# EasyEDA Pro project CM5_Mobo_final.epro, board PCB1
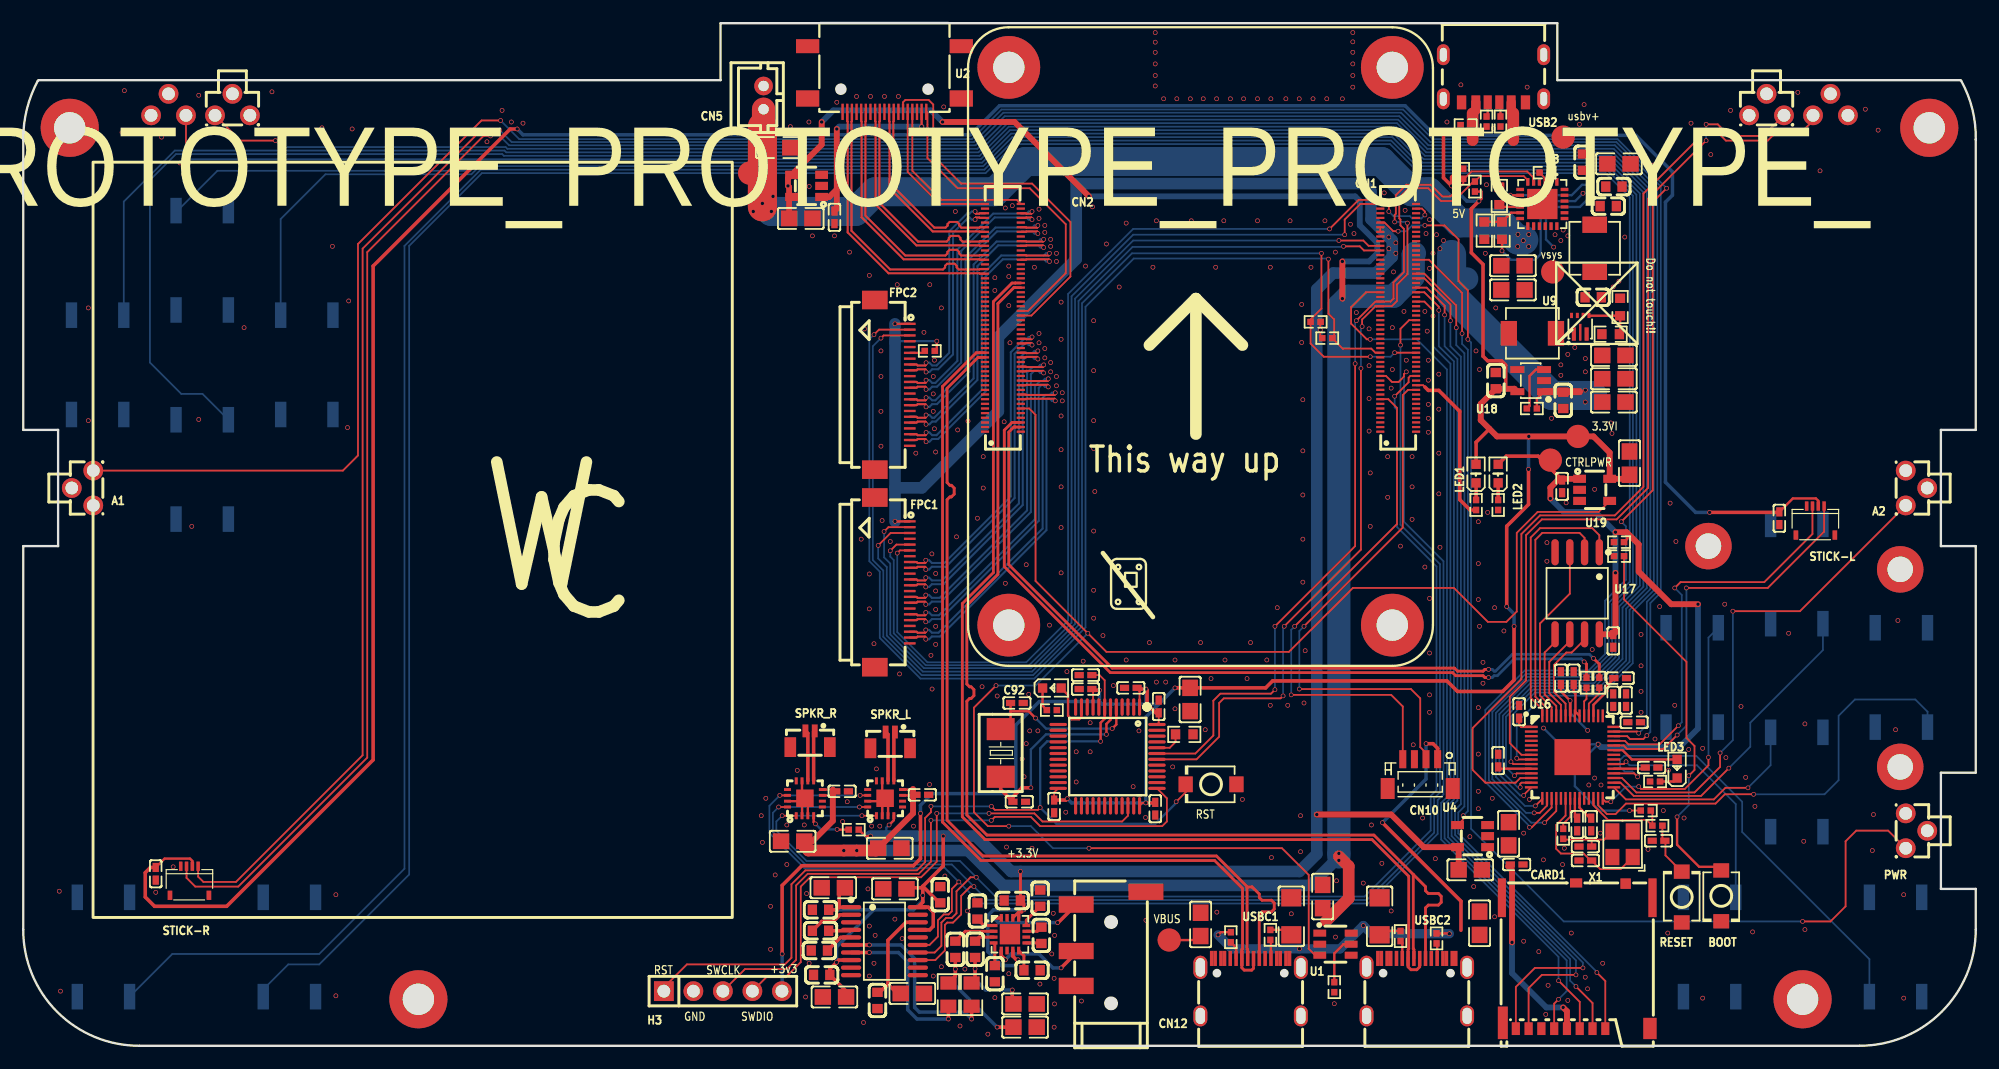
[diagram p1: board, top side]
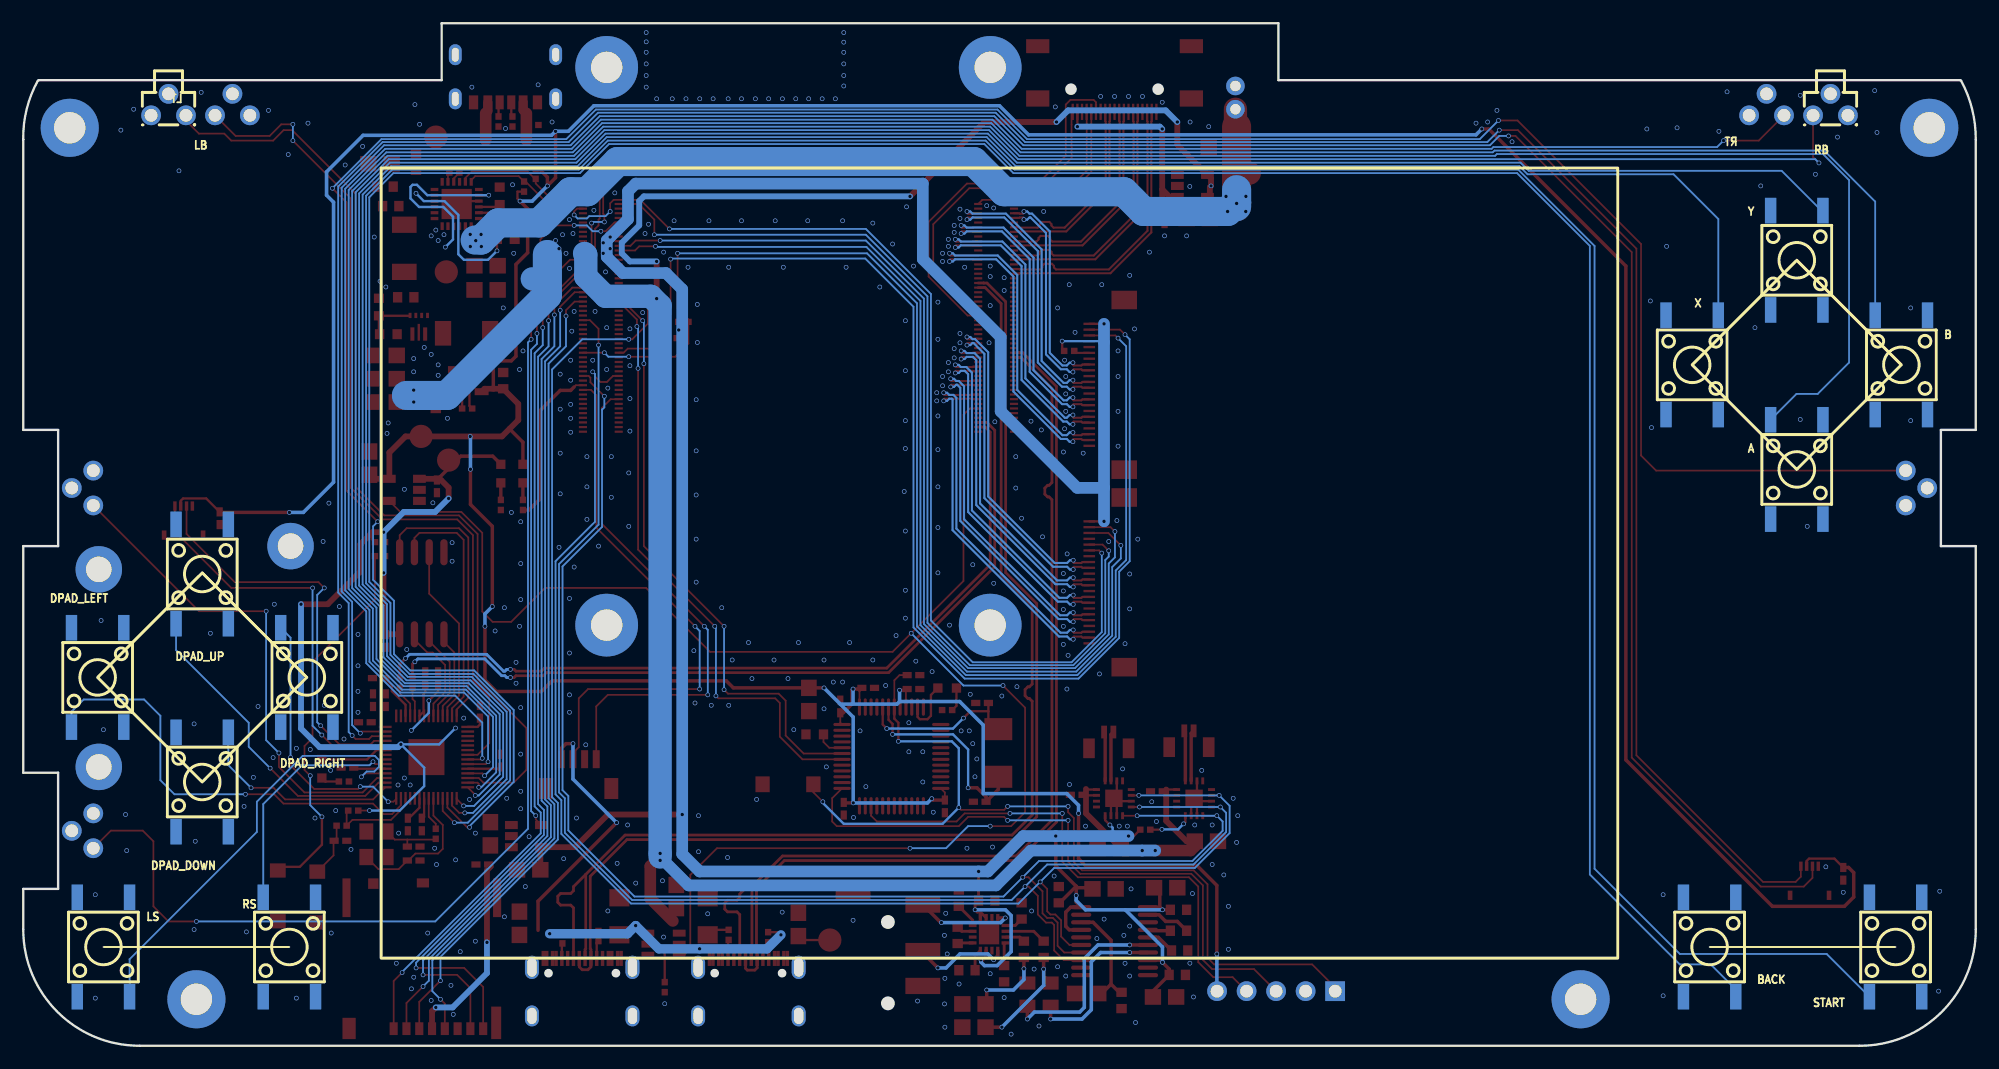
[diagram p2: board, bottom side, seen from below]

Outline 168 x 88 mm; copper layers: Top Layer, Inner1, Inner2, Bottom Layer. Coordinates in mm from the lower left corner of the outline.
Outline path: 168,78 arc(167.71,80.61) 166.75,83.05 arc(166.71,83.09) 166.66,83.1 132,83.1 132,88 60,88 60,83.1 1.34,83.1 arc(1.29,83.09) 1.26,83.05 arc(0.31,80.6) 0,78 0,53 3,53 3,43 0,43 0,10 arc(2.92,2.92) 10,0 158,0 arc(165.07,2.93) 168,10 168,13.5 165,13.5 165,23.5 168,23.5 168,43 165,43 165,53 168,53 168,78 ; 168,78 arc(168,77.99) 168,77.99
Stack: Top Layer 0.035mm 外层铜厚1oz / Dielectric1 0.2104mm 7628 RC49% 8.6mil / Inner1 0.0152mm 内层铜厚 / Dielectric2 1.065mm 1.1mm H/HOZ 含铜 / Inner2 0.0152mm 内层铜厚 / Dielectric3 0.2104mm 7628 RC49% 8.6mil / Bottom Layer 0.035mm 外层铜厚1oz

## Design rules (mm)
net MIPI1_D2_N: 100OHM, MIPI2
net HDMI0_SCL: 100OHM
net MIPI1_D3_P: 100OHM, MIPI1
net MIPI1_D2_P: 100OHM, MIPI2
net HDMI0_SDA: 100OHM
net MIPI1_D3_N: 100OHM, MIPI1
net MIPI1_C_P: 100OHM, MIPI5
net HDMI0_CLK_N: 100OHM, HDMI8
net HDMI0_CLK_P: 100OHM, HDMI8
net MIPI1_C_N: 100OHM, MIPI5
net HDMI0_TX0_N: 100OHM, HDMI7
net MIPI1_D1_P: 100OHM, MIPI3
net HDMI0_TX0_P: 100OHM, HDMI7
net MIPI1_D1_N: 100OHM, MIPI3
net HDMI0_TX1_N: 100OHM, HDMI6
net MIPI1_D0_P: 100OHM, MIPI4
net HDMI0_TX1_P: 100OHM, HDMI6
net MIPI1_D0_N: 100OHM, MIPI4
net HDMI0_TX2_N: 100OHM, HDMI5
net USB3-1-TX_P: 90OHM, USB3
net HDMI0_TX2_P: 100OHM, HDMI5
net USB3-1-TX_N: 90OHM, USB3
net HDMI1_CLK_N: 100OHM, HDMI4
net USB3-1-D_N: 90OHM, USB5
net HDMI1_CLK_P: 100OHM, HDMI4
net USB3-1-D_P: 90OHM, USB5
net HDMI1_TX0_N: 100OHM, HDMI3
net USB3-1-RX_P: 90OHM, USB4
net HDMI1_TX0_P: 100OHM, HDMI3
net USB3-1-RX_N: 90OHM, USB4
net HDMI1_TX1_N: 100OHM, HDMI2
net HDMI0_HOTPLUG: 100OHM
net HDMI1_TX1_P: 100OHM, HDMI2
net HDMI0_CEC: 100OHM
net HDMI1_CEC: 100OHM
net HDMI1_TX2_N: 100OHM, HDMI1
net HDMI1_SCL: 100OHM
net HDMI1_TX2_P: 100OHM, HDMI1
net HDMI1_SDA: 100OHM
net HDMI1_HOTPLUG: 100OHM
net USB3-0-TX_P: 90OHM, USB6
net MIPI0_D3_P: 100OHM, MIPI6
net MIPI0_D3_N: 100OHM, MIPI6
net USB3-0-TX_N: 90OHM, USB6
net USB3-0-D_N: 90OHM, USB8
net MIPI0_D2_P: 100OHM, MIPI7
net USB3-0-D_P: 90OHM, USB8
net MIPI0_D2_N: 100OHM, MIPI7
net MIPI0_C_P: 100OHM, MIPI10
net USB3-0-RX_P: 90OHM, USB7
net USB3-0-RX_N: 90OHM, USB7
net MIPI0_C_N: 100OHM, MIPI10
net MIPI0_D1_P: 100OHM, MIPI8
net MIPI0_D1_N: 100OHM, MIPI8
net MIPI0_D0_P: 100OHM, MIPI9
net MIPI0_D0_N: 100OHM, MIPI9
net USB2_P: 90OHM, USB9
net USB2_N: 90OHM, USB9
template: User Custom Config
spacing copperThickness1oz (default): track to track 0.102, other pairs 0.152 to 0.3
spacing copperThickness2oz: track to track 0.203, other pairs 0.152 to 0.3
track width copperThickness1oz (default): min 0.127, default 0.254, max 3
track width copperThickness2oz: min 0.203, default 0.254, max 2.54
differential pair differentialPair (default): width min 0.127, default 0.254, max 2.54; gap min 0.152, default 0.152
differential pair 100OHM: width min 0.177, default 0.177, max 0.177; gap min 0.15, default 0.15
differential pair 90OHM: width min 0.239, default 0.239, max 0.239; gap min 0.15, default 0.15
via viaSize (default): diameter min 0.4, default 0.61, max 10; hole min 0.3, default 0.305, max 6.3
net GND uses copperRegion1
net MIPI1_D2_N uses 100OHM
net MIPI1_D3_P uses 100OHM
net MIPI1_D2_P uses 100OHM
net MIPI1_D3_N uses 100OHM
net MIPI1_C_P uses 100OHM
net HDMI0_CLK_N uses 100OHM
net HDMI0_CLK_P uses 100OHM
net MIPI1_C_N uses 100OHM
net HDMI0_TX0_N uses 100OHM
net MIPI1_D1_P uses 100OHM
net HDMI0_TX0_P uses 100OHM
net MIPI1_D1_N uses 100OHM
net HDMI0_TX1_N uses 100OHM
net MIPI1_D0_P uses 100OHM
net HDMI0_TX1_P uses 100OHM
net MIPI1_D0_N uses 100OHM
net HDMI0_TX2_N uses 100OHM
net USB3-1-TX_P uses 90OHM
net HDMI0_TX2_P uses 100OHM
net USB3-1-TX_N uses 90OHM
net HDMI1_CLK_N uses 100OHM
net USB3-1-D_N uses 90OHM
net HDMI1_CLK_P uses 100OHM
net USB3-1-D_P uses 90OHM
net HDMI1_TX0_N uses 100OHM
net USB3-1-RX_P uses 90OHM
net HDMI1_TX0_P uses 100OHM
net USB3-1-RX_N uses 90OHM
net HDMI1_TX1_N uses 100OHM
net HDMI1_TX1_P uses 100OHM
net HDMI1_TX2_N uses 100OHM
net HDMI1_TX2_P uses 100OHM
net USB3-0-TX_P uses 90OHM
net MIPI0_D3_P uses 100OHM
net MIPI0_D3_N uses 100OHM
net USB3-0-TX_N uses 90OHM
net USB3-0-D_N uses 90OHM
net MIPI0_D2_P uses 100OHM
net USB3-0-D_P uses 90OHM
net MIPI0_D2_N uses 100OHM
net MIPI0_C_P uses 100OHM
net USB3-0-RX_P uses 90OHM
net USB3-0-RX_N uses 90OHM
net MIPI0_C_N uses 100OHM
net MIPI0_D1_P uses 100OHM
net MIPI0_D1_N uses 100OHM
net MIPI0_D0_P uses 100OHM
net MIPI0_D0_N uses 100OHM
net USB2_P uses 90OHM
net USB2_N uses 90OHM
diff pair MIPI2 uses 100OHM
diff pair MIPI1 uses 100OHM
diff pair MIPI5 uses 100OHM
diff pair HDMI8 uses 100OHM
diff pair HDMI7 uses 100OHM
diff pair MIPI3 uses 100OHM
diff pair HDMI6 uses 100OHM
diff pair MIPI4 uses 100OHM
diff pair HDMI5 uses 100OHM
diff pair USB3 uses 90OHM
diff pair HDMI4 uses 100OHM
diff pair USB5 uses 90OHM
diff pair HDMI3 uses 100OHM
diff pair USB4 uses 90OHM
diff pair HDMI2 uses 100OHM
diff pair HDMI1 uses 100OHM
diff pair USB6 uses 90OHM
diff pair MIPI6 uses 100OHM
diff pair USB8 uses 90OHM
diff pair MIPI7 uses 100OHM
diff pair MIPI10 uses 100OHM
diff pair USB7 uses 90OHM
diff pair MIPI8 uses 100OHM
diff pair MIPI9 uses 100OHM
diff pair USB9 uses 90OHM
pour e2095 uses copperRegion1
pour e2106 uses copperRegion1
pour e2120 uses copperRegion1
pour e2138 uses copperRegion1
pour e2159 uses copperRegion1
pour e2176 uses copperRegion1
pour e2191 uses copperRegion1
pour e2230 uses copperRegion1
pour e2257 uses copperRegion1
pour e2916 uses copperRegion1
pour e2929 uses copperRegion1
pour e2950 uses copperRegion1
pour e2967 uses copperRegion1
pour e3011 uses copperRegion1
pour e7991 uses copperRegion1
pour e20596 uses copperRegion1
pour e2682 uses copperRegion1
pour e2683 uses copperRegion1
pour e2693 uses copperRegion1
pour e2725 uses copperRegion1
pour e2745 uses copperRegion1
pour e2834 uses copperRegion1
pour e1493 uses copperRegion1
pour e649 uses copperRegion1
pour e1359 uses copperRegion1
pour e1825 uses copperRegion1
pour e1839 uses copperRegion1

## Placement (name value [footprint] x y rotation side)
A  K2-1102SP-C4SC-04  [key-smd_4p-l6.0-w6.0-p4.50-ls9.5-bl]  15.4 49.6 180 bottom
A1  BX-TS-26-454543BSJ  [sw-th_3p-l4.5-w4.3-p3.00-ls1.9]  5.1 48 270 top
A2  BX-TS-26-454543BSJ  [sw-th_3p-l4.5-w4.3-p3.00-ls1.9]  162.9 48 90 top
B  K2-1102SP-C4SC-04  [key-smd_4p-l6.0-w6.0-p4.50-ls9.5-bl]  6.4 58.6 180 bottom
BACK  K2-1102SP-C4SC-04  [key-smd_4p-l6.0-w6.0-p4.50-ls9.5-bl]  22.9 8.5 0 bottom
BOOT  TS-1088-AR02016  [SW-SMD_L3.9-W3.0-P4.45]  146.1 12.9 270 top
C2  33pF  [C0402]  134.41 15.94 0 top
C3  10uF  [C0805]  111.81 12.84 90 top
C5  10uF  [C0805]  125.31 10.54 90 top
C6  10uF  [C0805]  101.31 10.44 90 top
C7  100nF  [C0402]  132.31 31.64 270 top
C9  10uF  [C0805]  127.81 18.24 90 top
C10  22uF  [C0805]  136.86 55.4 0 top
C11  22uF  [C0805]  136.86 57.4 0 top
C12  22uF  [C0805]  136.86 59.41 0 top
C13  100nF  [C0402]  138.61 27.84 180 top
C14  100nF  [C0402]  128.71 28.74 270 top
C15  100nF  [C0402]  133.41 31.64 270 top
C16  100nF  [C0402]  136.81 29.74 270 top
C17  1uF  [C0603]  135.09 64.41 0 top
C18  10uF  [C0805]  65 77.3 0 top
C19  10uF  [C0805]  128.18 67.13 180 top
C20  10uF  [C0805]  128.18 65.05 180 top
C25  1uF  [C0603]  132.51 55.54 270 top
C26  10uF  [C0805]  100.4 29.8 270 top
C27  100nF  [C0402]  88.7 20.6 270 top
C28  100nF  [C0402]  91.4 30.7 180 top
C29  100nF  [C0402]  97.4 20.4 270 top
C30  100nF  [C0402]  95.3 30.8 180 top
C33  1uF  [C0603]  126.71 57.24 90 top
C34  47nF  [C0603]  136.38 72.26 180 top
C35  4.7uF  [C0603]  136.86 73.94 0 top
C36  10uF  [C0805]  137.3 75.9 180 top
C37  1uF  [C0603]  134.21 76.04 270 top
C38  47uF  [C1206]  109.11 11.14 90 top
C39  47uF  [C1206]  116.71 11.14 90 top
C40  10uF  [C0805]  66.2 17.6 180 top
C41  100nF  [C0402]  70.46 21.9 0 top
C42  10uF  [C0805]  74.56 17 0 top
C43  100nF  [C0402]  77.36 21.6 0 top
C52  10uF  [C0805]  66.9 71.2 0 top
C53  10uF  [C0805]  124.51 15.14 180 top
C54  100nF  [C0402]  128.5 15.6 180 top
C55  100nF  [C0402]  136.81 34.84 90 top
C56  1uF  [C0402]  137.91 29.74 90 top
C57  1uF  [C0402]  137.41 31.64 0 top
C58  100nF  [C0402]  134.91 19.04 90 top
C59  100nF  [C0402]  140.11 23.94 180 top
C60  100nF  [C0402]  133.71 19.04 90 top
C61  100nF  [C0402]  126.91 24.54 270 top
C62  33pF  [C0402]  134.41 17.14 0 top
C63  100nF  [C0402]  140.71 17.64 0 top
C64  100nF  [C0402]  151.1 45.4 270 top
C65  100nF  [C0402]  11.4 14.8 270 top
C66  10uF  [C0805]  138.21 50.14 270 top
C67  100nF  [C0402]  132.41 48.14 90 top
C68  100nF  [C0402]  97.7 29.2 90 top
C69  100nF  [C0402]  91.4 31.9 180 top
C70  2.2uF  [C0603]  68.6 9.9 0 top
C71  2.2uF  [C0603]  68.5 8.2 0 top
C72  10uF  [C0805]  75 13.5 0 top
C73  10uF  [C0805]  76.5 4.5 0 top
C74  10uF  [C0805]  69.8 4.2 0 top
C75  10uF  [C0805]  69.7 13.6 0 top
C76  100nF  [C0603]  78.9 13 270 top
C77  100nF  [C0603]  68.6 11.7 0 top
C78  100nF  [C0603]  68.7 6.1 0 top
C79  100nF  [C0603]  73.5 3.9 270 top
C80  2.2nF  [C0805]  86.2 1.6 0 top
C81  2.2nF  [C0805]  86.2 3.6 0 top
C82  1uF  [C0603]  80.2 8.3 270 top
C83  1uF  [C0603]  81.9 8.3 270 top
C84  1uF  [C0603]  82.1 11.6 90 top
C85  1uF  [C0603]  83.6 6.2 270 top
C86  2.2uF  [C0603]  85.1 12.5 180 top
C87  1uF  [C0603]  87.5 12.7 90 top
C88  1uF  [C0603]  87.6 9.5 90 top
C89  1uF  [C0603]  86.8 6.5 180 top
C92  20pF  [C0402]  85.5 29.5 0 top
C93  20pF  [C0402]  85.7 21 0 top
C94  100nF  [C0402]  69.8 71.3 270 top
CARD1  5033981892  [TF-SMD_503398-1892]  133.71 7.74 180 top
CN1  DF40HC(3.0)-100DS-0.4V(51)  [CONN-SMD_DF40HC-3.0-100DS-0.4V-51]  118.3 62.65 270 top
CN2  DF40HC(3.0)-100DS-0.4V(51)  [CONN-SMD_DF40HC-3.0-100DS-0.4V-51]  84.29 62.65 270 top
CN5  B2B-PH-K-S(LF)(SN)  [CONN-TH_B2B-PH-K-S]  63.7 81.6 90 top
CN10  BM04B-SRSS-TB(LF)(SN)  [CONN-SMD_BM04B-SRSS-TB]  120.2 23.4 180 top
CN12  PJ-320D  [AUDIO-SMD_PJ-320D]  93.6 9.2 180 top
DPAD_DOWN  K2-1102SP-C4SC-04  [key-smd_4p-l6.0-w6.0-p4.50-ls9.5-bl]  152.6 22.7 0 bottom
DPAD_LEFT  K2-1102SP-C4SC-04  [key-smd_4p-l6.0-w6.0-p4.50-ls9.5-bl]  161.6 31.7 180 bottom
DPAD_RIGHT  K2-1102SP-C4SC-04  [key-smd_4p-l6.0-w6.0-p4.50-ls9.5-bl]  143.6 31.7 180 bottom
DPAD_UP  K2-1102SP-C4SC-04  [key-smd_4p-l6.0-w6.0-p4.50-ls9.5-bl]  152.6 40.6 180 bottom
FPC1  FH12-22S-0.5SH(55)  [FPC-SMD_22P-P0.50_FH12-22S-0.5SH-55]  74.77 39.88 270 top
FPC2  FH12-22S-0.5SH(55)  [FPC-SMD_22P-P0.50_FH12-22S-0.5SH-55]  74.77 56.88 270 top
H3  PZ254V-11-05P  [hdr-th_5p-p2.54-v-m]  60.2 4.7 0 top
L2  1uH  [IND-SMD_L4.4-W4.2]  135.21 68.63 90 top
L3  1uH  [IND-SMD_L4.4-W4.2]  129.85 61.32 180 top
LB  BX-TS-26-454543BSJ  [sw-th_3p-l4.5-w4.3-p3.00-ls1.9]  155.5 81 0 bottom
LED1  KT-0603W  [LED0603-R-RD_WHITE]  125.01 49.24 90 top
LED2  KT-0603W  [LED0603-R-RD_WHITE]  126.91 49.24 90 top
LED3  KT-0603R  [LED0603-RD]  142.31 23.84 90 top
LED4  KT-0603R  [LED0603-RD]  88.5 30.78 0 top
LS  K2-1102SP-C4SC-04  [key-smd_4p-l6.0-w6.0-p4.50-ls9.5-bl]  161.1 8.5 0 bottom
LT  BX-TS-26-454543BSJ  [sw-th_3p-l4.5-w4.3-p3.00-ls1.9]  150 81 180 top
NOREF  -  [Pad_e12002]  161.5 41 0 top
NOREF#2  -  [Pad_e16]  133.77 52.44 0 top
NOREF#3  -  [Pad_e11]  124.2 66 0 top
NOREF#4  -  [Pad_e104]  164 79 0 top
NOREF#5  -  [Pad_e20]  34 4 0 top
NOREF#6  -  [Pad_e9068]  84.8 36.2 0 top
NOREF#7  -  [Pad_e52]  131.4 50.4 0 top
NOREF#8  -  [Pad_e17]  4 79 0 top
NOREF#9  -  [Pad_e9069]  117.8 36.2 0 top
NOREF#10  -  [Pad_e9065]  84.8 84.2 0 top
NOREF#11  -  [Pad_e36]  62.5 75.1 0 top
NOREF#12  -  [Pad_e12003]  161.5 24 0 top
NOREF#13  -  [Pad_e12000]  145 43 0 top
NOREF#14  -  [Pad_e21]  153.1 4 0 top
NOREF#15  -  [Pad_e24]  98.6 9.1 0 top
NOREF#16  -  [Pad_e3]  131.6 66.6 0 top
NOREF#17  -  [Pad_e0]  132.5 78.2 0 top
NOREF#18  -  [Pad_e9067]  117.8 84.2 0 top
PWR  BX-TS-26-454543BSJ  [sw-th_3p-l4.5-w4.3-p3.00-ls1.9]  162.9 18.5 90 top
R1  2.2kΩ  [R0402]  124.11 79.24 180 top
R2  15kΩ  [R0402]  112.81 5.04 270 top
R3  2.2kΩ  [R0402]  78 59.8 180 top
R4  2.2kΩ  [R0402]  111.2 62.3 180 top
R5  2.2kΩ  [R0402]  112.2 60.9 0 top
R6  1kΩ  [R0402]  125.01 46.54 270 top
R11  5.1kΩ  [R0402]  127.11 79.54 270 top
R12  5.1kΩ  [R0402]  125.91 79.54 270 top
R16  120Ω  [R0603]  127.01 73.14 90 top
R17  10kΩ  [R0603]  127.24 70.16 90 top
R18  10kΩ  [R0603]  125.71 70.16 270 top
R27  4.7kΩ  [R0402]  130.91 75.14 0 top
R29  750kΩ  [R0603]  136.58 61.24 180 top
R30  100kΩ  [R0603]  137.4 63.58 270 top
R31  10kΩ  [R0603]  99.9 26.8 0 top
R32  1.5kΩ  [R0402]  88.5 28.89 0 top
R34  220kΩ  [R0402]  71.46 18.6 0 top
R37  10kΩ  [R0402]  123.91 75.04 90 top
R38  10kΩ  [R0402]  124.91 73.94 270 top
R39  1kΩ  [R0402]  126.91 46.54 270 top
R43  56kΩ  [R0402]  121.61 9.24 90 top
R44  56kΩ  [R0402]  118.51 9.44 90 top
R45  56kΩ  [R0402]  107.31 9.54 90 top
R46  56kΩ  [R0402]  103.91 9.34 90 top
R47  22Ω  [R0402]  134.51 31.24 270 top
R48  22Ω  [R0402]  135.61 31.24 90 top
R49  1kΩ  [R0402]  132.51 18.24 90 top
R50  1kΩ  [R0402]  140.61 18.94 180 top
R51  1kΩ  [R0402]  137.31 42.14 180 top
R52  10kΩ  [R0402]  139.61 20.24 0 top
R53  10kΩ  [R0402]  137.31 43.34 0 top
R54  1kΩ  [R0402]  140.41 22.74 0 top
R55  1kΩ  [R0402]  129.81 54.84 180 top
R56  470Ω  [R0805]  79.6 4.4 90 top
R57  470Ω  [R0805]  81.6 4.4 90 top
RB  BX-TS-26-454543BSJ  [sw-th_3p-l4.5-w4.3-p3.00-ls1.9]  12.5 81 0 bottom
RESET  TS-1088-AR02016  [SW-SMD_L3.9-W3.0-P4.45]  142.7 12.8 90 top
RS  K2-1102SP-C4SC-04  [key-smd_4p-l6.0-w6.0-p4.50-ls9.5-bl]  145.1 8.5 180 bottom
RST  TS-1088-AR02016  [SW-SMD_L3.9-W3.0-P4.45]  102.2 22.5 180 top
RT  BX-TS-26-454543BSJ  [sw-th_3p-l4.5-w4.3-p3.00-ls1.9]  18 81 180 top
SPKR_L  BM02B-SURS-TF(LF)(SN)  [CONN-SMD_2P-P0.80_BM02B-SURS-TF-LF-SN]  74.6 26.3 0 top
SPKR_R  BM02B-SURS-TF(LF)(SN)  [CONN-SMD_2P-P0.80_BM02B-SURS-TF-LF-SN]  67.7 26.4 0 top
START  K2-1102SP-C4SC-04  [key-smd_4p-l6.0-w6.0-p4.50-ls9.5-bl]  6.9 8.5 180 bottom
STICK-L  FH19C-4S-0.5SH(10)  [FPC-SMD_FH19C-4S-0.5SH]  154.2 45.2 0 top
STICK-R  FH19C-4S-0.5SH(10)  [FPC-SMD_FH19C-4S-0.5SH]  14.3 14.2 0 top
U1  AP22653W6-7  [SOT-23-6_L2.9-W1.6-P0.95-LS2.8-BR]  112.91 8.74 180 top
U2  HDMI-519S  [HDMI-SMD_19P-P0.40-H-F_HDMI-519S]  74.1 83.2 180 top
U4  RT9742GGJ5  [TSOT-23-5_L2.9-W1.6-P0.95-LS2.8-BR]  124.71 18.04 0 top
U5  STM32F103C8T6  [LQFP-48_L7.0-W7.0-P0.50-LS9.0-BL]  93.3 24.9 180 top
U8  BQ25890RTWR  [WQFN-24_L4.0-W4.0-P0.50-BL-EP]  130.71 72.44 180 top
U9  TPS61022RWUR  [VQFN-7_L2.0-W2.0-P0.55-TL_RWU]  133.97 62.05 90 top
U11  MAX98357AETE+T  [TQFN-16_L3.0-W3.0-P0.50-BL-EP1.5]  74.16 21.3 0 top
U12  MAX98357AETE+T  [TQFN-16_L3.0-W3.0-P0.50-BL-EP1.5]  67.26 21.3 0 top
U15  RT9742GGJ5  [TSOT-23-5_L2.9-W1.6-P0.95-LS2.8-BR]  67.4 74 0 top
U16  RP2040  [LQFN-56_L7.0-W7.0-P0.4-EP]  133.31 24.84 0 top
U17  W25Q128JVSIQTR  [SOIC-8_L5.3-W5.3-P1.27-LS8.0-BL]  133.71 38.94 180 top
U18  TPSPX3819M5-L-3-3  [SOT-23-5_L3.0-W1.6-P0.95-LS2.8-BR]  129.71 57.24 0 top
U19  RT9742GGJ5  [TSOT-23-5_L2.9-W1.6-P0.95-LS2.8-BR]  135.21 47.84 180 top
U20  PCM5102APWR  [TSSOP-20_L6.5-W4.4-P0.65-LS6.4-BL]  74.1 9 270 top
U21  PAM8908JER  [QFN-16_L3.0-W3.0-P0.50-BL-EP1.7]  84.9 9.6 270 top
USB2  TYPE-C-31-M-17  [USB-C-SMD_10P-P1.00-L6.8-W8.9]  126.51 83.24 180 top
USBC1  TYPE-C-31-M-12  [USB-C_SMD-TYPE-C-31-M-12]  105.61 5.04 0 top
USBC2  TYPE-C-31-M-12  [USB-C_SMD-TYPE-C-31-M-12]  119.91 5.04 0 top
X  K2-1102SP-C4SC-04  [key-smd_4p-l6.0-w6.0-p4.50-ls9.5-bl]  24.4 58.6 0 bottom
X1  12MHz  [OSC-SMD_4P-L3.2-W2.5-BL]  137.61 17.34 90 top
X2  8MHz  [CRYSTAL-SMD_L5.0-W3.2]  84.1 25.2 90 top
Y  K2-1102SP-C4SC-04  [key-smd_4p-l6.0-w6.0-p4.50-ls9.5-bl]  15.4 67.6 0 bottom

## Footprints (pads in the part's own frame, mm; a bottom-side part is the same pattern mirrored in y, then rotated)
AUDIO-SMD_PJ-320D
  rect 3x1.4 smd: 1(-3,-4.05) 2(3,4.05) 3(3,1.05) 4(3,-2.95)
C0402
  rect 0.79x0.54 smd: 1(-0.545,0) 2(0.545,0)
C0603
  rect 0.8x0.9 smd: 1(-0.7,0) 2(0.7,0)
C0805
  rect 1.41x1.35 smd: 1(-1,0) 2(1,0)
C1206
  rect 1.485x1.728 smd: 1(-1.593,0) 2(1.593,0)
CONN-SMD_2P-P0.80_BM02B-SURS-TF-LF-SN
  rect 0.5x1.1 smd: 1(0.4,0.7) 2(-0.4,0.7)
  rect 1x1.7 smd: 3(-1.7,-0.7) 4(1.7,-0.7)
CONN-SMD_BM04B-SRSS-TB
  rect 1.2x1.8 smd: 0(-2.8,1.262) 0(2.8,1.262)
  rect 0.6x1.55 smd: 1(-1.5,-1.262) 2(-0.5,-1.262) 3(0.5,-1.262) 4(1.5,-1.262)
CONN-SMD_DF40HC-3.0-100DS-0.4V-51
  rect 0.19x0.7 smd: 1(9.8,1.54) 2(9.8,-1.54) 3(9.4,1.54) 4(9.4,-1.54) 5(9,1.54) 6(9,-1.54) 7(8.6,1.54) 8(8.6,-1.54) 9(8.2,1.54) 10(8.2,-1.54) 11(7.8,1.54) 12(7.8,-1.54) 13(7.4,1.54) 14(7.4,-1.54) 15(7,1.54) 16(7,-1.54) 17(6.6,1.54) 18(6.6,-1.54) 19(6.2,1.54) 20(6.2,-1.54) 21(5.8,1.54) 22(5.8,-1.54) 23(5.4,1.54) 24(5.4,-1.54) 25(5,1.54) 26(5,-1.54) 27(4.6,1.54) 28(4.6,-1.54) 29(4.2,1.54) 30(4.2,-1.54) 31(3.8,1.54) 32(3.8,-1.54) 33(3.4,1.54) 34(3.4,-1.54) 35(3,1.54) 36(3,-1.54) 37(2.6,1.54) 38(2.6,-1.54) 39(2.2,1.54) 40(2.2,-1.54) 41(1.8,1.54) 42(1.8,-1.54) 43(1.4,1.54) 44(1.4,-1.54) 45(1,1.54) 46(1,-1.54) 47(0.6,1.54) 48(0.6,-1.54) 49(0.2,1.54) 50(0.2,-1.54) 51(-0.2,1.54) 52(-0.2,-1.54) 53(-0.6,1.54) 54(-0.6,-1.54) 55(-1,1.54) 56(-1,-1.54) 57(-1.4,1.54) 58(-1.4,-1.54) 59(-1.8,1.54) 60(-1.8,-1.54) 61(-2.2,1.54) 62(-2.2,-1.54) 63(-2.6,1.54) 64(-2.6,-1.54) 65(-3,1.54) 66(-3,-1.54) 67(-3.4,1.54) 68(-3.4,-1.54) 69(-3.8,1.54) 70(-3.8,-1.54) 71(-4.2,1.54) 72(-4.2,-1.54) 73(-4.6,1.54) 74(-4.6,-1.54) 75(-5,1.54) 76(-5,-1.54) 77(-5.4,1.54) 78(-5.4,-1.54) 79(-5.8,1.54) 80(-5.8,-1.54) 81(-6.2,1.54) 82(-6.2,-1.54) 83(-6.6,1.54) 84(-6.6,-1.54) 85(-7,1.54) 86(-7,-1.54) 87(-7.4,1.54) 88(-7.4,-1.54) 89(-7.8,1.54) 90(-7.8,-1.54) 91(-8.2,1.54) 92(-8.2,-1.54) 93(-8.6,1.54) 94(-8.6,-1.54) 95(-9,1.54) 96(-9,-1.54) 97(-9.4,1.54) 98(-9.4,-1.54) 99(-9.8,1.54) 100(-9.8,-1.54)
CONN-TH_B2B-PH-K-S
  round 1.6 hole 0.9: 1(1,0) 2(-1,0)
CRYSTAL-SMD_L5.0-W3.2
  rect 1.9x2.4 smd: 1(-2.05,0) 2(2.05,0)
FPC-SMD_22P-P0.50_FH12-22S-0.5SH-55
  rect 0.2x1 smd: 1(5.25,1.505) 2(4.75,1.505) 3(4.25,1.505) 4(3.75,1.505) 5(3.25,1.505) 6(2.75,1.505) 7(2.25,1.505) 8(1.75,1.505) 9(1.25,1.505) 10(0.75,1.505) 11(0.25,1.505) 12(-0.25,1.505) 13(-0.75,1.505) 14(-1.25,1.505) 15(-1.75,1.505) 16(-2.25,1.505) 17(-2.75,1.505) 18(-3.25,1.505) 19(-3.75,1.505) 20(-4.25,1.505) 21(-4.75,1.505) 22(-5.25,1.505)
  rect 1.6x2.2 smd: 23(7.3,-1.505) 24(-7.3,-1.505)
FPC-SMD_FH19C-4S-0.5SH
  rect 0.3x0.8 smd: 1(-0.75,1.25) 2(-0.25,1.25) 3(0.25,1.25) 4(0.75,1.25)
  rect 0.4x0.8 smd: 5(1.675,-1.25) 6(-1.675,-1.25)
HDMI-SMD_19P-P0.40-H-F_HDMI-519S
  rect 0.2x1.4 smd: 1(3.6,2.825) 2(3.2,2.825) 3(2.8,2.825) 4(2.4,2.825) 5(2,2.825) 6(1.6,2.825) 7(1.2,2.825) 8(0.8,2.825) 9(0.4,2.825) 10(0,2.824) 11(-0.4,2.825) 12(-0.8,2.825) 13(-1.2,2.825) 14(-1.6,2.825) 15(-2,2.825) 16(-2.4,2.825) 17(-2.8,2.825) 18(-3.2,2.825) 19(-3.6,2.825)
  rect 2x1.2 smd: 20(6.61,-2.825) 21(-6.61,-2.825)
  rect 2x1.4 smd: 22(6.61,1.675) 23(-6.61,1.675)
hdr-th_5p-p2.54-v-m
  rect 1.7x1.7 hole 1.1: 1(-5.08,0)
  round 1.7 hole 1.1: 2(-2.54,0) 3(0,0) 4(2.54,0) 5(5.08,0)
IND-SMD_L4.4-W4.2
  rect 1.4x2.12 smd: 1(2.028,0) 2(-2.028,0)
key-smd_4p-l6.0-w6.0-p4.50-ls9.5-bl
  rect 0.98x2.2 smd: 1(-2.25,-4.275) 2(-2.25,4.275) 3(2.25,-4.275) 4(2.25,4.275)
LED0603-R-RD_WHITE
  rect 0.8x0.8 smd: 1(0.8,0) 2(-0.8,0)
LED0603-RD
  rect 0.8x0.8 smd: 1(-0.799,0) 2(0.799,0)
LQFN-56_L7.0-W7.0-P0.4-EP
  rect 1.1x0.2 smd: 1(-3.55,2.6) 2(-3.55,2.2) 3(-3.55,1.8) 4(-3.55,1.4) 5(-3.55,1) 6(-3.55,0.6) 7(-3.55,0.2) 8(-3.55,-0.2) 9(-3.55,-0.6) 10(-3.55,-1) 11(-3.55,-1.4) 12(-3.55,-1.8) 13(-3.55,-2.2) 14(-3.55,-2.6) 29(3.55,-2.6) 30(3.55,-2.2) 31(3.55,-1.8) 32(3.55,-1.4) 33(3.55,-1) 34(3.55,-0.6) 35(3.55,-0.2) 36(3.55,0.2) 37(3.55,0.6) 38(3.55,1) 39(3.55,1.4) 40(3.55,1.8) 41(3.55,2.2) 42(3.55,2.6)
  rect 0.2x1.1 smd: 15(-2.6,-3.55) 16(-2.2,-3.55) 17(-1.8,-3.55) 18(-1.4,-3.55) 19(-1,-3.55) 20(-0.6,-3.55) 21(-0.2,-3.55) 22(0.2,-3.55) 23(0.6,-3.55) 24(1,-3.55) 25(1.4,-3.55) 26(1.8,-3.55) 27(2.2,-3.55) 28(2.6,-3.55) 43(2.6,3.55) 44(2.2,3.55) 45(1.8,3.55) 46(1.4,3.55) 47(1,3.55) 48(0.6,3.55) 49(0.2,3.55) 50(-0.2,3.55) 51(-0.6,3.55) 52(-1,3.55) 53(-1.4,3.55) 54(-1.8,3.55) 55(-2.2,3.55) 56(-2.6,3.55)
  rect 3.1x3.1 smd: 57(0,0)
LQFP-48_L7.0-W7.0-P0.50-LS9.0-BL
  oval 0.27x1.5 smd: 1(-2.75,-4.25) 2(-2.25,-4.25) 3(-1.75,-4.25) 4(-1.25,-4.25) 5(-0.75,-4.25) 6(-0.25,-4.25) 7(0.25,-4.25) 8(0.75,-4.25) 9(1.25,-4.25) 10(1.75,-4.25) 11(2.25,-4.25) 12(2.75,-4.25) 25(2.75,4.25) 26(2.25,4.25) 27(1.75,4.25) 28(1.25,4.25) 29(0.75,4.25) 30(0.25,4.25) 31(-0.25,4.25) 32(-0.75,4.25) 33(-1.25,4.25) 34(-1.75,4.25) 35(-2.25,4.25) 36(-2.75,4.25)
  oval 1.5x0.27 smd: 13(4.25,-2.75) 14(4.25,-2.25) 15(4.25,-1.75) 16(4.25,-1.25) 17(4.25,-0.75) 18(4.25,-0.25) 19(4.25,0.25) 20(4.25,0.75) 21(4.25,1.25) 22(4.25,1.75) 23(4.25,2.25) 24(4.25,2.75) 37(-4.25,2.75) 38(-4.25,2.25) 39(-4.25,1.75) 40(-4.25,1.25) 41(-4.25,0.75) 42(-4.25,0.25) 43(-4.25,-0.25) 44(-4.25,-0.75) 45(-4.25,-1.25) 46(-4.25,-1.75) 47(-4.25,-2.25) 48(-4.25,-2.75)
OSC-SMD_4P-L3.2-W2.5-BL
  rect 1.4x1.2 smd: 1(-1.1,-0.875) 2(1.1,-0.875) 3(1.1,0.875) 4(-1.1,0.875)
Pad_e0
  round 2 smd: TP1(0,0)
Pad_e3
  round 2 smd: TP1(0,0)
Pad_e11
  round 2 smd far side: TP1(0,0)
Pad_e16
  round 2 smd: TP1(0,0)
Pad_e17
  round 5 hole 2.7: 101(0,0)
Pad_e20
  round 5 hole 2.7: 101(0,0)
Pad_e21
  round 5 hole 2.7: 101(0,0)
Pad_e24
  round 2 smd: TP1(0,0)
Pad_e36
  round 2 smd: TP3(0,0)
Pad_e52
  round 2 smd: TP5(0,0)
Pad_e104
  round 5 hole 2.7: 101(0,0)
Pad_e9065
  round 5.4 hole 2.7: 102(0,0)
Pad_e9067
  round 5.4 hole 2.7: 102(0,0)
Pad_e9068
  round 5.4 hole 2.7: 102(0,0)
Pad_e9069
  round 5.4 hole 2.7: 102(0,0)
Pad_e12000
  round 4 hole 2.2: 3(0,0)
Pad_e12002
  round 4 hole 2.2: 3(0,0)
Pad_e12003
  round 4 hole 2.2: 3(0,0)
QFN-16_L3.0-W3.0-P0.50-BL-EP1.7
  rect 0.28x0.665 smd: 1(-0.75,-1.407) 2(-0.25,-1.407) 3(0.25,-1.407) 4(0.75,-1.407) 9(0.75,1.407) 10(0.25,1.407) 11(-0.25,1.407) 12(-0.75,1.407)
  rect 0.665x0.28 smd: 5(1.407,-0.75) 6(1.407,-0.25) 7(1.407,0.25) 8(1.407,0.75) 13(-1.407,0.75) 14(-1.407,0.25) 15(-1.407,-0.25) 16(-1.407,-0.75)
  rect 1.75x1.75 smd: 17(0,0)
R0402
  rect 0.566x0.54 smd: 1(-0.433,0) 2(0.433,0)
R0603
  rect 0.806x0.864 smd: 1(-0.753,0) 2(0.753,0)
R0805
  rect 1.133x1.377 smd: 1(-1,0) 2(1,0)
SOIC-8_L5.3-W5.3-P1.27-LS8.0-BL
  oval 0.63x2.25 smd: 1(-1.905,-3.53) 2(-0.635,-3.53) 3(0.635,-3.53) 4(1.905,-3.53) 5(1.905,3.53) 6(0.635,3.53) 7(-0.635,3.53) 8(-1.905,3.53)
SOT-23-5_L3.0-W1.6-P0.95-LS2.8-BR
  rect 1.2x0.6 smd: 1(1.15,-0.95) 2(1.15,0) 3(1.15,0.95) 4(-1.15,0.95) 5(-1.15,-0.95)
SOT-23-6_L2.9-W1.6-P0.95-LS2.8-BR
  rect 1.1x0.6 smd: 1(1.35,-0.95) 2(1.35,0) 3(1.35,0.95) 4(-1.35,0.95) 5(-1.35,0) 6(-1.35,-0.95)
SW-SMD_L3.9-W3.0-P4.45
  rect 1.23x1.36 smd: 1(-2.185,0) 2(2.185,0)
sw-th_3p-l4.5-w4.3-p3.00-ls1.9
  round 1.7 hole 1.1: 1(-1.5,0.925) 2(1.5,0.925) 3(0,-0.925)
TF-SMD_503398-1892
  rect 0.7x1.1 smd: 1(-2.42,6.27) 2(-1.32,6.27) 3(-0.22,6.27) 4(0.88,6.27) 5(1.98,6.27) 6(3.08,6.27) 7(4.18,6.27) 8(5.28,6.27)
  rect 1.05x0.78 smd: 9(0.095,-6.27)
  rect 0.9x0.9 smd: 10(-4.17,-6.21)
  rect 0.7x3.33 smd: 11(-6.48,-4.995) 11(6.48,-4.995)
  rect 1.14x1.83 smd: 11(-6.26,6.255)
  rect 0.86x2.8 smd: 11(6.4,5.77)
TQFN-16_L3.0-W3.0-P0.50-BL-EP1.5
  rect 0.25x0.6 smd: 1(-0.749,-1.5) 2(-0.248,-1.5) 3(0.252,-1.5) 4(0.751,-1.5) 9(0.75,1.5) 10(0.25,1.5) 11(-0.25,1.5) 12(-0.749,1.5)
  rect 0.6x0.25 smd: 5(1.5,-0.748) 6(1.5,-0.248) 7(1.5,0.252) 8(1.5,0.752) 13(-1.5,0.752) 14(-1.5,0.252) 15(-1.5,-0.248) 16(-1.5,-0.748)
  rect 1.5x1.5 smd: 17(0,0)
TSOT-23-5_L2.9-W1.6-P0.95-LS2.8-BR
  rect 1.1x0.7 smd: 1(1.294,-0.951) 2(1.294,-0.001) 3(1.294,0.951) 4(-1.294,0.951) 5(-1.294,-0.949)
TSSOP-20_L6.5-W4.4-P0.65-LS6.4-BL
  oval 0.364x1.742 smd: 1(-2.925,-2.871) 2(-2.275,-2.871) 3(-1.625,-2.871) 4(-0.975,-2.871) 5(-0.325,-2.871) 6(0.325,-2.871) 7(0.975,-2.871) 8(1.625,-2.871) 9(2.275,-2.871) 10(2.925,-2.871) 11(2.925,2.871) 12(2.275,2.871) 13(1.625,2.871) 14(0.975,2.871) 15(0.325,2.871) 16(-0.325,2.871) 17(-0.975,2.871) 18(-1.625,2.871) 19(-2.275,2.871) 20(-2.925,2.871)
USB-C-SMD_10P-P1.00-L6.8-W8.9
  oval 1.1x1.8 hole 0.6x1.2: 0(-4.32,1.75) 0(-4.32,-2.05) 0(4.32,1.75) 0(4.32,-2.05)
  rect 0.8x1.2 smd: 1(-2.749,2.05) 6(2.749,2.05)
  rect 0.76x1.2 smd: 2(-1.52,2.05) 5(1.52,2.05)
  rect 0.7x1.2 smd: 3(-0.5,2.05) 4(0.5,2.05)
USB-C_SMD-TYPE-C-31-M-12
  oval 1.2x2 hole 0.8x1.6: 0(-4.325,1.706) 1(4.325,1.706)
  oval 1.2x1.8 hole 0.8x1.4: 2(4.325,-2.474) 3(-4.325,-2.474)
  rect 0.3x1.3 smd: A1(-3.35,2.474) A4(-2.55,2.474) A5(-1.25,2.474) A6(-0.25,2.474) A7(0.25,2.474) A8(1.25,2.474) A9(2.55,2.474) A12(3.35,2.474) B1(3.05,2.474) B4(2.25,2.474) B5(1.75,2.474) B6(0.75,2.474) B7(-0.75,2.474) B8(-1.75,2.474) B9(-2.25,2.474) B12(-3.05,2.474)
VQFN-7_L2.0-W2.0-P0.55-TL_RWU
  rect 1.15x0.35 smd: 1(-0.8,0.55) 3(-0.8,-0.55)
  rect 1.45x0.2 smd: 2(-0.65,0)
  rect 0.45x0.25 smd: 4(0.8,-0.75) 5(0.8,-0.25) 6(0.8,0.25) 7(0.8,0.75)
WQFN-24_L4.0-W4.0-P0.50-BL-EP
  rect 0.28x0.665 smd: 1(-1.25,-1.907) 2(-0.75,-1.907) 3(-0.25,-1.907) 4(0.25,-1.907) 5(0.75,-1.907) 6(1.25,-1.907) 13(1.25,1.907) 14(0.75,1.907) 15(0.25,1.907) 16(-0.25,1.907) 17(-0.75,1.907) 18(-1.25,1.907)
  rect 0.665x0.28 smd: 7(1.907,-1.25) 8(1.907,-0.75) 9(1.907,-0.25) 10(1.907,0.25) 11(1.907,0.75) 12(1.907,1.25) 19(-1.907,1.25) 20(-1.907,0.75) 21(-1.907,0.25) 22(-1.907,-0.25) 23(-1.907,-0.75) 24(-1.907,-1.25)
  rect 2.6x2.6 smd: 25(0,0)

## Nets
As in the schematic, except:
+3.3VI: C26.1 C27.1 C28.1 C29.1 C30.1 C33.1 C64.1 C65.1 C66.2 C68.1 H3.5 LED1.1 NOREF#2.TP1 R37.2 R38.2 STICK-L.3 STICK-R.3 U5.1 U5.9 U5.24 U5.36 U5.48 U18.5 U19.5
+5V: C3.1 C10.1 C11.1 C12.1 C25.1 C40.1 C41.1 C42.1 C43.1 C52.1 CN1.77 CN1.79 CN1.81 CN1.83 CN1.85 CN1.87 NOREF#3.TP1 R29.2 R55.1 U1.1 U9.3 U11.7 U11.8 U12.7 U12.8 U15.4 U15.5 U18.1
GND: A.3 A.4 A1.2 A2.2 B.3 B.4 BACK.3 BACK.4 BOOT.2 C2.1 C3.2 C5.2 C6.2 C7.1 C9.2 C10.2 C11.2 C12.2 C13.1 C14.1 C15.1 C16.1 C17.2 C18.2 C19.2 C20.2 C25.2 C26.2 C27.2 C28.2 C29.2 C30.2 C33.2 C35.2 C36.1 C37.1 C38.2 C39.2 C40.2 C41.2 C42.2 C43.2 C52.2 C53.1 C54.1 C55.1 C56.2 C57.2 C58.1 C59.1 C60.1 C61.1 C62.1 C63.1 C64.2 C65.2 C66.1 C67.1 C68.2 C69.2 C71.1 C72.1 C73.2 C74.1 C75.1 C76.1 C77.1 C78.1 C79.2 C80.2 C81.2 C84.2 C85.2 C86.2 C87.2 C89.1 C92.2 C93.2 C94.2 CARD1.6 CARD1.11 CN1.1 CN1.2 CN1.7 CN1.8 CN1.13 CN1.14 CN1.22 CN1.23 CN1.32 CN1.33 CN1.42 CN1.43 CN1.52 CN1.53 CN1.59 CN1.60 CN1.65 CN1.66 CN1.71 CN1.74 CN1.98 CN2.7 CN2.8 CN2.13 CN2.14 CN2.19 CN2.20 CN2.25 CN2.26 CN2.31 CN2.32 CN2.37 CN2.38 CN2.44 CN2.50 CN2.55 CN2.56 CN2.61 CN2.62 CN2.67 CN2.68 CN2.73 CN2.74 CN2.79 CN2.80 CN2.85 CN2.86 CN2.91 CN2.92 CN2.97 CN2.98 CN5.1 CN10.3 CN12.1 CN12.2 DPAD_DOWN.3 DPAD_DOWN.4 DPAD_LEFT.3 DPAD_LEFT.4 DPAD_RIGHT.3 DPAD_RIGHT.4 DPAD_UP.3 DPAD_UP.4 FPC1.1 FPC1.4 FPC1.7 FPC1.10 FPC1.13 FPC1.16 FPC1.19 FPC1.23 FPC1.24 FPC2.1 FPC2.4 FPC2.7 FPC2.10 FPC2.13 FPC2.16 FPC2.19 FPC2.23 FPC2.24 H3.2 LB.2 LS.3 LS.4 LT.2 NOREF.3 NOREF#4.101 NOREF#5.101 NOREF#8.101 NOREF#12.3 NOREF#13.3 NOREF#14.101 PWR.2 R1.2 R2.2 R11.2 R12.2 R16.2 R18.2 R30.1 R31.2 R32.2 R39.2 R54.1 RB.1 RESET.1 RS.3 RS.4 RST.1 RT.1 START.3 START.4 STICK-L.1 STICK-R.1 U1.2 U2.1 U2.4 U2.7 U2.10 U2.13 U2.20 U2.21 U2.22 U2.23 U4.2 U5.8 U5.23 U5.35 U5.47 U8.9 U8.17 U8.18 U8.25 U9.1 U11.2 U11.3 U11.11 U11.15 U11.17 U12.2 U12.3 U12.11 U12.15 U12.17 U15.2 U16.19 U16.57 U17.4 U18.2 U19.2 U20.3 U20.9 U20.10 U20.11 U20.12 U20.16 U20.19 U21.6 U21.10 U21.15 U21.17 USB2.0 USB2.1 USB2.6 USBC1.0 USBC1.1 USBC1.2 USBC1.3 USBC1.A1 USBC1.A12 USBC1.B1 USBC1.B12 USBC2.0 USBC2.1 USBC2.2 USBC2.3 USBC2.A1 USBC2.A12 USBC2.B1 USBC2.B12 X.3 X.4 Y.3 Y.4
VBUS: C5.1 C6.1 C38.1 C39.1 CN10.1 NOREF#15.TP1 R43.2 R44.2 R45.2 R46.2 U1.6 USBC1.A4 USBC1.A9 USBC1.B4 USBC1.B9 USBC2.A4 USBC2.A9 USBC2.B4 USBC2.B9
BAT+: C18.1 CN5.2 NOREF#11.TP3 U8.13 U8.14
CTRL_PWR: C13.2 C14.2 C15.2 C16.2 C55.2 C56.1 C59.2 C60.2 C61.2 C67.2 LED2.1 NOREF#7.TP5 R52.1 R53.2 U16.1 U16.10 U16.22 U16.33 U16.42 U16.43 U16.44 U16.48 U16.49 U17.8 U19.1
USB_V+: C37.2 NOREF#17.TP1 R1.1 U8.1 USB2.2 USB2.5
VSYS: C17.1 C19.1 C20.1 L2.2 L3.1 NOREF#16.TP1 U8.8 U8.15 U8.16 U9.5 U9.6 U9.7

Pads without a net: A 1; A1 3; A2 3; B 1; BACK 1; CARD1 9 10; CN10 0; DPAD_DOWN 2; DPAD_LEFT 2; DPAD_RIGHT 1; DPAD_UP 2; FPC2 18; LB 3; LS 1; LT 3; NOREF#6 102; NOREF#9 102; NOREF#10 102; NOREF#18 102; PWR 3; RB 3; RS 1; RT 3; SPKR_L 3 4; SPKR_R 3 4; START 2; STICK-L 5 6; STICK-R 5 6; U1 4; U2 17; U4 3; U5 2 3 4 10 12 13 14 15 16 17 18 19 20 21 22 25 26 27 28 29 30 31 32 33 38 39 40 41 45 46; U8 4 7 12 24; U11 5 6 12 13; U12 5 6 12 13; U15 3; U16 2 3 4 5 6 24 25 35 36; U18 4; U19 3; USBC1 A8 B8; USBC2 A8 B8; X 2; X1 2 4; Y 2

## Via types
v1: diameter 0.4, hole 0.3, Top Layer to Bottom Layer, 684 vias

## Routing (per net, layer and track width the routed paths; a pad name or vN(x,y) marks a point on that pad's centre or on a via; arc(x,y) is an arc through that point)
+1.8V: length 0.4
  Top Layer w0.15: CN1.88 CN1.90
+1V1: length 12.2
  Top Layer w0.2: U16.45 135.11,29.34 136.28,30.52 136.28,31.02 136.86,31.6 ; 134.81,19.59 133.91,20.49 U16.23 ; v1(133.1,29.7) 132.31,30.49 132.31,31.1
  Top Layer w0.239: v1(133.1,29.7) 133.11,29.69 U16.50
  Bottom Layer w0.2: v1(133.1,29.7) 133.1,28.65 v1(134.61,27.14)
+3.3V: length 260.7
  Top Layer w0.15: R5.1 111.6,61.07 v1(111.6,61.6) 111.6,62.27 R4.1
  Top Layer w0.2: 78.41,59.68 78.61,59.88 v1(78.61,60.64) ; R34.2 72.44,18.05 v1(72.9,18.05) ; v1(74.5,19) 74.91,19.41 U11.4 ; v1(75.01,62.13) FPC2.22 ; v1(75.01,45.13) FPC1.22
  Top Layer w0.25: 85.65,11.51 85.91,11.51 v1(86.1,11.7) 86.1,12.2 C86.1 v1(85.8,15) ; 85.65,11.51 U21.13 ; 85.65,11.51 U21.14
  Top Layer w0.3: U20.17 77.99,9.97 78.3,10.28 78.3,11.5 77.88,11.92 76.97,11.92 77.4,12.35 v1(77.4,12.94) 77.4,13.72 ; 77.4,13.72 79.16,15.48 v1(79.16,18.05) ; 77.4,13.72 77.28,13.6 76,13.6 ; 77.4,13.72 78.82,12.3 C76.2 ; 70.21,11.92 v1(69.98,11.7) C77.2 ; 70.21,11.92 71.23,11.92 ; 70.21,11.92 70.21,13.11 C75.2 ; v1(85.6,7.4) 85.46,7.4 85.15,7.71 U21.7 ; C74.2 70.8,4.7 C78.2 69.4,6.6 v1(69.98,7.18) 70.18,7.38 U20.8
  Top Layer w0.5: C53.2 123.51,17 U4.5 120.51,17.09 117.7,19.9 v1(111.3,19.9)
  Bottom Layer w0.2: 75.01,60.54 75.11,60.64 v1(78.61,60.64) ; v1(74.5,19) 74.26,18.76 74.26,18.05
  Bottom Layer w0.3: 73.18,11.7 76.6,11.7 77.4,12.5 v1(77.4,12.94) ; 73.18,11.7 v1(69.98,11.7) ; 73.18,11.7 69.98,8.5 v1(69.98,7.18) ; v1(85.6,7.4) 85.6,7.2 85.3,6.9 84.2,6.9 83,8.1 83,11.21 83.49,11.7 v1(86.1,11.7)
  Bottom Layer w1: v1(75.01,62.13) 75.01,48.02 ; v1(72.9,18.05) v1(79.16,18.05) 81.95,18.05 85,15 v1(85.8,15) 109.8,15 111.3,16.5 v1(111.3,19.9) 111.3,65.1 112.7,66.5 116.4,66.5 117.79,67.89 117.79,69.31 v1(117.5,69.6) 115.97,71.13 115.97,73.53 115.3,74.2 90.6,74.2 90.6,67.7 83.9,61 83.9,54.6 77.32,48.02 75.01,48.02 ; 75.01,48.02 v1(75.01,45.13)
  vias: v1(117.5,68.6) v1(118.1,69.1) v1(118.1,68.2)
+3.3VI: length 430.9
  Top Layer w0.15: U5.9 92.05,30.59 92.05,30.6 ; 97.7,28.66 97.7,27.8 U5.48 ; U5.24 88.7,21.8 C27.1 ; 96.05,30.59 U5.1 ; U5.36 96.3,20.9 v1(96.59,20.9)
  Top Layer w0.2: STICK-L.3 154.45,46.9 154.25,47.1 152.26,47.1 C64.1 ; C65.1 12.16,16.1 14.35,16.1 14.55,15.9 STICK-R.3 ; v1(125.26,72.69) 125.47,72.91 125.47,73.51 124.91,73.51
  Top Layer w0.3: v1(96.59,20.9) 97.36,20.9 C29.1 ; v1(92.6,30.6) 92.05,30.6 C28.1 ; v1(129.52,49.61) 129.52,46.59 127.64,44.71 v1(127.64,37.8) ; v1(125.26,72.69) 124.6,72.04 124.6,68.25 125.61,67.24 125.61,59.34 126.01,58.94 127.19,58.94 127.55,58.58 127.55,56.54 ; v1(89.83,21.27) 89.71,21.14 C27.1 ; v1(99.1,30.8) C26.1 106.9,30.8 107.5,31.4 122.5,31.4 123.41,30.49 127.29,30.49 128.28,31.47 v1(128.28,36.1) ; v1(42.5,78.9) 41.9,78.9 30.11,67.11 30.11,24.61 17.5,12 11.3,12 10.5,12.8 10.5,14.9 10.95,15.34 C65.1 ; 95.94,30.7 96.05,30.59 ; 95.94,30.7 C30.1 ; 95.94,30.7 v1(96.6,30.7) 96.7,30.6 96.7,29.4 97.44,28.66 97.7,28.66 ; C64.1 151.06,45.9 v1(145.1,45.9) ; v1(65.3,7.9) 65.3,13.8 67,15.5 76.6,15.5 77.2,16.1 v1(77.2,20) ; 126.16,53.09 125.01,51.94 LED1.1 ; R37.2 123.62,75.47 122.9,74.75 v1(122.9,74) 122.2,74.7 v1(122.2,78.7)
  Top Layer w0.5: C66.2 137.86,48.79 U19.5 136.5,51.05 135.11,52.44 NOREF#2.TP1 v1(129.54,52.44) 126.81,52.44 126.16,53.09 125.41,53.84 125.41,53.84 125.41,55.24 C33.1 128.31,56.54 U18.5
  Bottom Layer w0.3: v1(92.6,30.6) 92.6,29.62 ; 92.6,29.62 87.42,29.62 85.4,27.6 85.4,21.7 78.2,21.7 77.2,20.7 v1(77.2,20) ; 92.6,29.62 92.82,29.4 96.7,29.4 ; v1(42.5,78.9) 43,78.4 81.5,78.4 84,80.9 118.9,80.9 121.1,78.7 v1(122.2,78.7) 122.55,78.35 138.76,78.35 141.9,75.21 141.9,73.2 141.3,72.6 141.3,48.5 143.9,45.9 v1(145.1,45.9) ; v1(129.54,52.44) 129.52,52.42 v1(129.52,49.61) ; 97.7,29.4 96.7,29.4 ; 97.7,29.4 v1(99.1,30.8) ; 97.7,29.4 96.59,28.29 v1(96.59,20.9) 90.2,20.9 v1(89.83,21.27) ; 96.7,29.4 96.6,29.5 v1(96.6,30.7) ; v1(127.64,37.8) 128.28,37.17 v1(128.28,36.1) ; H3.5 65.3,4.72 v1(65.3,7.9) ; v1(122.9,74) 124.21,72.69 v1(125.26,72.69)
+5V: length 227
  Top Layer w0.2: 76.56,22.1 76.51,22.05 U11.8 ; U18.1 130.24,55.67 R55.1 ; U11.7 76.77,21.55 C43.1 ; U12.7 69.65,21.55 69.66,21.55 ; U12.8 69.66,22.05
  Top Layer w0.5: v1(68.7,79.5) 68.7,77.54 U15.4 65.8,74.64 v1(65.8,74) 65.9,73.9 65.9,72.84 ; 76.56,22.1 76.56,20 C42.1 ; v1(113.5,64.3) v1(113.5,67.5) ; C40.1 67.91,17.6 69.66,19.35 69.66,22.05 ; 65.9,72.84 U15.5 ; 65.9,72.84 C52.1 ; v1(79.1,79.5) 85.3,79.5 v1(91.7,73.1)
  Top Layer w0.6: U18.1 133.91,56.29
  Top Layer w1: 112.11,10.74 114.05,12.68 114.05,15.45 113.2,16.3 ; C42.1 73.36,16.8 v1(71.72,16.8) v1(70.6,16.8) 67.56,16.8 67.2,17.16 C40.1
  Bottom Layer w0.5: v1(79.1,79.5) 78.1,80.5 69.7,80.5 v1(68.7,79.5) ; v1(113.5,67.5) 115.8,67.5 116.5,68.2 116.5,69.1 115,70.6 115,72.7 114.6,73.1 v1(91.7,73.1)
  Bottom Layer w1: v1(70.6,16.8) v1(71.72,16.8) 81.3,16.8 84.3,13.8 110.75,13.8 113.2,16.25
  Bottom Layer w2: 119.7,68.19 119.6,68.09 119.6,66.2 117.9,64.5 114,64.5 113.2,63.7 v1(113.2,16.56) 113.2,16.25
  Bottom Layer w2.5: 135.03,55.97 131.53,55.97 122.9,64.6 122.9,68.1
  vias: v1(113.2,15.95) v1(120.7,69.9) v1(121.3,68.2) v1(121.6,69.8) v1(121.9,68.6) v1(122.2,69.3) v1(134.41,59.14) v1(134.41,58) v1(134.41,56.43) v1(134.4,55.4)
GND: length 13.4
  Top Layer w0.2: U11.11 73.91,21.55 U11.17 73.91,21.05 U11.15 ; U11.2 73.91,21.05 ; U8.9 130.46,72.69 U8.25 ; U12.2 67.01,21.05 ; U11.3 74.41,21.05 ; U12.15 67.01,21.05 U12.17 67.01,21.55 U12.11 ; U12.3 67.51,21.05
  vias: v1(3.1,13.3) v1(3.2,4.7) v1(5.6,63.5) v1(5.6,53.8) v1(8.5,78.6) v1(8.7,82.2) v1(11.4,13.21) v1(11.9,78.2) v1(12.9,15.4) v1(13.8,75) v1(14.5,44.7) v1(15.1,81.8) v1(15.1,53.9) v1(18.5,74) v1(19,61.8) v1(21.4,82.1) v1(22.1,78.7) v1(25.7,79) v1(26.6,68.8) v1(26.9,13) v1(26.9,4.3) v1(27.9,53.2) v1(28,64.1) v1(28.3,78.9) v1(39.9,77.8) v1(41.2,80.5) v1(42,79.5) v1(43,79.4) v1(63.5,19.8) v1(63.6,17.5) v1(63.89,21.3) v1(64.3,12) v1(64.3,8.3) v1(64.7,14.7) v1(65.7,19) v1(65.7,15.6) v1(66,79.1) v1(66.6,23.7) v1(67.2,19) v1(67.31,4.2) v1(67.4,13.1) v1(67.6,79.5) v1(67.63,73.95) v1(67.62,7.11) v1(67.9,69.7) v1(69.8,69.7) v1(70,81.2) v1(70.5,19.3) v1(70.9,21) v1(71.1,68.3) v1(71.7,81.7) v1(72.1,43.6) v1(72.3,2) v1(72.38,61.69) v1(72.68,13.5) v1(72.8,66.3) v1(72.8,40.6) v1(72.8,37.6) v1(72.8,10.3) v1(72.8,6) v1(72.9,81.7) v1(73,18.9) v1(73.2,34.6) v1(73.2,7.1) v1(73.3,9.5) v1(73.41,23.83) v1(73.7,18.9) v1(73.8,59.8) v1(73.8,57.6) v1(73.8,54.6) v1(73.8,51.6) v1(73.9,45.2) v1(74.1,81.7) v1(74.6,43.4) v1(75,10.9) v1(75.2,65.5) v1(75.3,81.7) v1(75.4,32) v1(75.62,9.23) v1(76.6,18.9) v1(76.8,51) v1(77.5,61.4) v1(78,65.5) v1(77.98,22.49) v1(78.1,33.6) v1(78.18,42.33) v1(78.2,30.7) v1(78.3,57.6) v1(78.3,56.1) v1(78.3,54.6) v1(78.3,6) v1(78.4,59) v1(78.4,53.1) v1(78.5,51.1) v1(78.51,40.64) v1(78.51,39.14) v1(78.51,37.54) v1(78.51,36.1) v1(78.51,34.54) v1(79,63.5) v1(79,6.8) v1(79.2,80.8) v1(79.3,14.61) v1(80.2,71.8) v1(80.3,43.8) v1(80.4,53) v1(80.6,1.7) v1(81.02,6.6) v1(81.24,11.6) v1(81.29,53.75) v1(82.1,45.4) v1(82.5,30.9) v1(82.6,50.7) v1(82.6,48) v1(83,1) v1(83.6,66.1) v1(83.6,65) v1(83.6,4.14) v1(83.8,30.1) v1(84.4,53.7) v1(84.5,72.1) v1(84.5,39.8) v1(84.6,17.1) v1(84.8,67.1) v1(84.8,66.2) v1(84.8,63.7) v1(84.8,6.2) v1(84.9,60.5) v1(85.1,72.3) v1(85.95,24.68) v1(86.11,23.15) v1(86.3,41.4) v1(86.3,26) v1(86.52,30.25) v1(86.6,27.1) v1(86.8,17) v1(87,67) v1(87.3,27.1) v1(87.4,72) v1(87.4,71.2) v1(87.4,61.3) v1(87.4,60.5) v1(87.48,5.31) v1(87.9,70.6) v1(87.9,70) v1(87.9,60) v1(87.9,59.2) v1(88.3,36.2) v1(88.4,69.4) v1(88.4,68.8) v1(88.4,58.8) v1(88.4,58) v1(88.5,7.9) v1(88.63,11.4) v1(88.74,9.5) v1(88.7,5.8) v1(88.73,3.6) v1(88.7,1.6) v1(88.9,68.2) v1(88.9,67.5) v1(88.9,57.6) v1(88.9,56.8) v1(89.3,64) v1(89.3,60.8) v1(89.3,54.2) v1(89.3,51.3) v1(89.3,48.1) v1(89.3,44.6) v1(89.3,40.7) v1(89.4,56.2) v1(89.4,55.5) v1(89.7,20.1) v1(89.8,32.2) v1(90.6,25.3) v1(90.6,22.7) v1(91.05,3.85) v1(91.2,33.1) v1(91.4,67.1) v1(91.8,27.8) v1(91.8,25.3) v1(92,72.2) v1(92.1,62.4) v1(92.1,58.1) v1(92.1,53.8) v1(92.1,51.4) v1(92.1,44.3) v1(92.1,39.2) v1(92.1,36.8) v1(92.2,47.7) v1(92.9,35.3) v1(93.2,69) v1(93.8,31) v1(94.3,65.3) v1(94.9,70.8) v1(94.9,33.2) v1(95.5,22.3) v1(96,27.1) v1(96.56,19.64) v1(96.6,10.8) v1(96.9,34.7) v1(97.2,67) v1(97.4,87.2) v1(97.4,86.37) v1(97.4,85.5) v1(97.4,84.5) v1(97.4,83.5) v1(97.4,82.6) v1(97.5,71) v1(97.5,31.3) v1(98.12,81.5) v1(98.3,31.3) v1(98.9,24) v1(99.1,33.2) v1(99.1,29) v1(99.26,81.5) v1(100.42,81.5) v1(100.5,71) v1(101.3,34.7) v1(101.53,81.5) v1(101.7,27.2) v1(102.2,31.6) v1(102.6,67) v1(102.68,81.5) v1(102.7,11.5) v1(103.3,71) v1(103.4,33.2) v1(103.87,81.5) v1(104.9,21.2) v1(105,81.5) v1(105.3,31.6) v1(105.6,34.7) v1(106.2,81.5) v1(106.2,71) v1(107,33.2) v1(107.35,81.5) v1(107.3,67) v1(107.3,29.3) v1(107.4,16.2) v1(107.9,37.7) v1(108.64,81.5) v1(108.8,29.3) v1(109,71) v1(109.11,11.36) v1(109.79,81.5) v1(109.9,19.8) v1(109.9,16.7) v1(110,63.8) v1(110,60.52) v1(110.1,55.6) v1(110.1,51.2) v1(110.1,47.4) v1(110.1,43.6) v1(110.1,39.9) v1(110.2,29.5) v1(110.3,34) v1(110.8,67) v1(110.97,81.5) v1(112,71) v1(112.16,81.5) v1(112.81,3.62) v1(112.9,68.3) v1(112.91,9.36) v1(113,14.2) v1(113.5,81.5) v1(114.2,70.7) v1(114.4,87.2) v1(114.4,86.4) v1(114.4,85.5) v1(114.4,84.5) v1(114.4,83.5) v1(114.4,82.5) v1(114.5,69.9) v1(114.7,63.1) v1(115.3,14) v1(115.8,61.7) v1(115.8,58.52) v1(115.8,55.7) v1(115.8,52.9) v1(115.9,49.3) v1(115.9,44.7) v1(116,19) v1(116.9,15.7) v1(117.1,73.4) v1(117.4,50.7) v1(117.4,47.2) v1(117.7,56.6) v1(117.7,11.6) v1(117.8,61.8) v1(117.8,58.2) v1(117.9,66.6) v1(118.5,43) v1(118.8,63.2) v1(118.9,71.9) v1(119,59) v1(119.5,50.7) v1(119.5,48.1) v1(119.5,45.3) v1(119.6,25.9) v1(120.4,19.6) v1(120.6,63.2) v1(120.6,41.2) v1(120.8,61.5) v1(120.9,59) v1(120.9,57.28) v1(120.9,55.2) v1(120.9,54) v1(120.9,52.8) v1(121,71.1) v1(121,66.9) v1(121,38.5) v1(121,33.8) v1(121,30.2) v1(121,28.7) v1(121.5,16.1) v1(121.8,57.8) v1(121.8,54.79) v1(121.8,51) v1(121.8,47.5) v1(121.9,42.9) v1(122.5,79.5) v1(123.7,82.7) v1(124.47,18) v1(124.8,13.7) v1(125,59.8) v1(125.2,45.1) v1(125.2,41.5) v1(125.2,38.4) v1(125.2,29.1) v1(125.2,25.1) v1(125.2,21.9) v1(125.2,20.4) v1(125.3,58.2) v1(125.3,36.1) v1(125.6,33) v1(125.6,31.2) v1(125.8,68.2) v1(125.9,74.1) v1(126,45.9) v1(126.4,21.3) v1(126.51,78.94) v1(126.6,37.7) v1(126.6,11.1) v1(126.7,63.5) v1(127.4,35.7) v1(129.1,18.3) v1(129.1,9) v1(129.4,82.5) v1(129.6,21.2) v1(130.1,28.2) v1(130.4,8.1) v1(130.8,16) v1(131,2.7) v1(131.1,43.3) v1(131.1,41.7) v1(131.2,5.2) v1(131.5,54) v1(131.8,69.8) v1(132.3,69.3) v1(132.3,58.6) v1(132.3,57.7) v1(132.45,15.6) v1(132.5,70.2) v1(132.6,17) v1(132.75,46.73) v1(132.9,69.7) v1(132.9,59.5) v1(132.9,3.9) v1(133.2,9.7) v1(133.5,60.1) v1(133.9,79.3) v1(134.3,81) v1(134.4,5.9) v1(134.6,4.9) v1(134.71,22.44) v1(135,34.1) v1(135.21,47.89) v1(135.21,23.04) v1(135.7,18.3) v1(135.76,22.44) v1(135.9,7.1) v1(136.6,53.6) v1(136.7,52.7) v1(136.8,65.3) v1(137.3,65.8) v1(137.8,69.6) v1(138.8,77.4) v1(139.2,35.4) v1(139.2,32.7) v1(139.2,30.5) v1(139.2,28.7) v1(139.8,16.9) v1(140.3,75.8) v1(140.4,26.4) v1(140.8,37.8) v1(141.12,20.24) v1(141.5,9.7) v1(141.55,23.7) v1(141.7,46.7) v1(142.1,29.3) v1(142.2,43.4) v1(142.9,19.6) v1(143.3,25.5) v1(143.5,79.4) v1(144.5,25.6) v1(144.5,4.1) v1(145.2,76.7) v1(146.4,38) v1(146.5,24.8) v1(146.9,80.5) v1(147.8,29.2) v1(148.2,23.1) v1(148.8,9.8) v1(149,20.6) v1(151.9,35.5) v1(152.69,82.05) v1(153.2,17.6) v1(153.3,27.7) v1(153.3,10) v1(154.6,75.3) v1(158.5,80.6) v1(159.1,16.8) v1(159.2,19.9) v1(159.6,78.8) v1(161.1,27.2) v1(161.3,36.6) v1(161.8,13) v1(161.8,4.1)
VBUS: length 53.2
  Top Layer w0.2: C6.1 100.96,9.1 NOREF#15.TP1 ; C38.1 108.68,9.97 R45.2 ; C39.1 117.03,9.88 R44.2 ; v1(122.71,9.64) 122.67,9.67 R43.2 ; 104.01,9.78 103.04,9.78 v1(102.81,9.54)
  Top Layer w0.3: CN10.1 121.7,25.6 121.3,26 v1(120.7,26) ; v1(116.95,19.2) 123.71,12.44 123.71,9.94
  Bottom Layer w0.3: v1(116.95,19.2) 120.7,22.95 v1(120.7,26)
  Bottom Layer w0.8: v1(102.81,9.54) 104.01,8.34 v1(109.81,8.34) 113.31,8.34 v1(115.31,10.34) 116.01,9.64 v1(122.71,9.64)
VBUS_EN: length 139.5
  Top Layer w0.15: U19.4 135.55,45.94 130.31,45.94 128.51,44.14 128.51,37.37 127.62,36.48 126.02,36.48 123.1,39.4 114.4,39.4 108.9,33.9 93.2,33.9 v1(91.6,35.5) 87.1,40 87.1,54.3 86.55,54.85 CN2.11 ; v1(83.7,31) 81.8,29.1 81.8,20.1 83,18.9 v1(84.8,18.9) ; v1(91.7,17) 108.31,17 110.61,14.7 110.61,8.34 111.16,7.79 U1.3
  Bottom Layer w0.15: v1(91.7,17) 88.6,17 86.7,18.9 v1(84.8,18.9) ; v1(83.7,31) 87.1,31 v1(91.6,35.5)
A1: length 233
  Top Layer w0.15: v1(141.4,73.8) 140.2,72.6 140.2,47.8 v1(137.5,45.1) ; v1(41.07,79.63) 39.43,79.63 28.8,69 28.8,50.8 27.5,49.5 A1.1 ; 131.51,21.29 131.51,20.51 129.8,18.8 v1(129.6,18.8)
  Bottom Layer w0.15: v1(41.07,79.63) 42.68,78.02 81.62,78.02 84.17,80.57 118.73,80.57 121.28,78.02 137.18,78.02 141.4,73.8 v1(141.4,73.8) ; v1(129.6,18.8) 129.6,18.9 125.8,22.7 125.8,28.9 129.2,32.3 134.7,32.3 136.1,33.7 136.1,38.3 137.9,40.1 137.9,44.7 v1(137.5,45.1)
A2: length 43.1
  Top Layer w0.15: v1(147.1,37.4) 152.88,37.4 A2.1 ; U16.31 137.56,23.04 138.8,21.8 143.8,21.8 146,24 v1(146,25.2)
  Bottom Layer w0.15: v1(147.1,37.4) 147.1,26.3 v1(146,25.2)
BAT+: length 80
  Top Layer w2: CN5.2 63.7,79.4
  Top Layer w2.5: 63.6,72.2 v1(63.6,72.49) 63.6,79.1
  Bottom Layer w2.5: 63.6,73.67 63.6,72.57 ; 63.6,72.57 63.6,72.22 ; 63.6,72.57 v1(64.38,71.8) 71.6,71.8 73.3,73.5 83.62,73.5 86.22,76.1 116.86,76.1 119.46,73.5 120.91,73.5 123.59,70.82 127.13,70.82 128.61,69.34 129.11,69.34
  vias: v1(62.8,73.1) v1(62.81,71.8) v1(64.51,73.1) v1(128.61,69.82) v1(128.58,68.78) v1(129.07,69.29) v1(129.54,69.82) v1(129.53,68.78)
CAM_GPIO0: length 89.8
  Top Layer w0.15: v1(75.2,42.4) 75.43,42.63 FPC1.17 ; v1(112.4,70.3) 114.9,72.8 117.2,72.8 117.5,72.5 v1(117.5,71.8) ; v1(120.6,71.5) 120.6,71.8 120.35,72.05 CN1.97
  Bottom Layer w0.15: v1(112.4,70.3) 95.5,70.3 89.9,64.7 89.9,36.6 86.3,33 77.8,33 75.2,35.6 v1(75.2,42.4) ; v1(120.6,71.5) 120.3,71.2 119.5,71.2 119.3,71.4 117.9,71.4 v1(117.5,71.8)
CAM_GPIO1: length 85.8
  Top Layer w0.15: v1(113.7,69.8) 113.7,71.1 115.05,72.45 CN1.100 ; FPC1.18 75.13,43.13 v1(74.6,42.6)
  Bottom Layer w0.15: v1(74.6,42.6) 74.6,42.1 74.9,41.8 74.9,35.5 77.65,32.75 86.55,32.75 90.2,36.4 90.2,64.5 95.5,69.8 v1(113.7,69.8)
CC1: length 1.3
  Top Layer w0.2: R11.1 127.11,81.09 USB2.3
CC2: length 1.3
  Top Layer w0.2: USB2.4 126.01,80.07 R12.1
CTRL_PWR: length 87.6
  Top Layer w0.15: R52.1 v1(138.21,20.24)
  Top Layer w0.2: 133.51,21.29 133.51,19.69 133.61,19.59 ; U16.1 128.91,27.44 128.71,27.64 128.71,28.2 ; 133.91,28.39 133.56,28.74 133.56,30.29 133.41,30.44 133.41,31.1 ; 126.91,24 127.06,23.84 U16.10 ; C59.2 139.46,23.84 U16.33 ; 138.01,44.14 138.01,43.61 R53.2
  Top Layer w0.3: C67.2 130.35,50.74 127.61,50.74 LED2.1
  Top Layer w0.5: U19.1 132.41,48.79 C67.2 132.05,48.69 131.4,48.04 v1(131.4,47.1) ; U17.8 136.78,35.41 C55.2 137,35.58 v1(137,40.7) ; v1(137,44.2) 137.95,44.2 138.01,44.14 139,43.15 139,40.8 141.8,38 v1(144.1,38)
  Bottom Layer w0.2: v1(138.21,20.24) 135.61,20.24 133.51,22.34 133.51,23.94 v1(135.51,25.94) 132.21,25.94 v1(130.81,27.34)
  Bottom Layer w0.5: v1(135.51,25.94) 135.75,25.7 142.5,25.7 144.1,27.3 v1(144.1,38) ; v1(137,40.7) v1(137,44.2) 135.26,45.94 132.56,45.94 v1(131.4,47.1)
DOWN: length 18
  Top Layer w0.15: U16.29 137.9,21.2 145.46,21.2 146.46,22.2 v1(148.4,22.2)
  Bottom Layer w0.15: DPAD_DOWN.1 150.35,24.15 v1(148.4,22.2)
FAN_PWM: length 46.5
  Top Layer w0.15: CN10.2 120.7,25.2 120.2,25.7 120.2,29.9 119.4,30.7 v1(109.8,30.7) ; CN1.19 119.15,56.45 118.7,56 118.7,44.6 v1(110.2,36.1)
  Bottom Layer w0.15: v1(110.2,36.1) 109.8,35.7 v1(109.8,30.7)
FAN_TACHO: length 44.8
  Top Layer w0.15: v1(109.4,36.1) 118.2,44.9 118.2,54.9 117.45,55.65 CN1.16 ; v1(109.1,30.2) 117.7,30.2 118.7,29.2 CN10.4
  Bottom Layer w0.15: v1(109.1,30.2) 109.1,35.8 v1(109.4,36.1)
GPIO2: length 75.1
  Top Layer w0.15: v1(107.7,30.64) 107.36,30.3 103,30.3 102.4,29.7 102.4,26.7 100.85,25.15 U5.43 ; v1(107.7,36.1) 114.6,43 v1(114.6,58.7) ; U8.6 129.46,74.49 129.11,74.84 125.37,74.84 R38.1 124.78,74.38 123.1,72.7 122,72.7 120.9,73.8 119.2,73.8 118.4,73 118.4,71.2 118.5,71.1 118.5,70.6 118.8,70.3 118.8,66.6 117.9,65.7 117.9,64.3 117.65,64.05 CN1.58 116.35,64.05 v1(114.7,62.4)
  Bottom Layer w0.15: v1(114.6,58.7) 114.6,62.3 v1(114.7,62.4) ; v1(107.7,36.1) v1(107.7,30.64)
GPIO3: length 78.6
  Top Layer w0.15: U8.5 129.96,74.69 129.41,75.24 124.61,75.24 123.97,74.61 123.91,74.61 123.91,74.21 122.8,73.1 122.1,73.1 121.1,74.1 119,74.1 118.1,73.2 118.1,71.6 118,71.5 v1(118,70.9) ; v1(115.1,58.3) 115.1,42.7 v1(108.5,36.1) ; v1(119.1,70.8) 119.1,66.4 118.2,65.5 118.2,64.1 117.75,63.65 CN1.56 116.35,63.65 115.2,62.5 v1(115.2,61.9) ; v1(108.4,30.11) 108.19,29.9 103.3,29.9 102.9,29.5 102.9,26.6 100.95,24.65 U5.42
  Bottom Layer w0.15: v1(119.1,70.8) 119,70.9 v1(118,70.9) ; v1(108.5,36.1) 108.4,36 v1(108.4,30.11) ; v1(115.1,58.3) 115.1,61.8 v1(115.2,61.9)
GPIO18: length 128.8
  Top Layer w0.15: U20.13 78.47,7.38 79.3,8.2 79.3,10.4 79.5,10.6 80,10.6 80.7,11.3 80.7,12.9 81.5,13.7 v1(81.8,13.7) ; v1(71.95,20.55) 72.66,20.55 ; v1(118.5,60.3) 118.5,61.7 119.25,62.45 CN1.49 ; U12.16 65,20.55
  Bottom Layer w0.15: v1(118.5,60.3) 118.5,44.85 121.9,41.45 121.9,21.8 121.4,21.3 121.4,18.34 115.61,12.54 82.96,12.54 v1(81.8,13.7) 79.9,15.6 67.3,15.6 64.5,18.4 64.5,20.05 v1(65,20.55) v1(71.95,20.55)
GPIO19: length 126.4
  Top Layer w0.15: v1(72.01,21.55) 72.66,21.55 ; v1(65.1,21.55) 65.76,21.55 ; v1(119,58) 118.8,57.8 118.8,57.59 118.34,57.13 117.77,57.13 117.25,57.65 CN1.26 ; v1(80.5,14.1) 79.9,13.5 79.9,11.58 79.62,11.3 79.2,11.3 78.7,10.8 78.7,9.4 77.97,8.67 U20.15
  Bottom Layer w0.15: v1(72.01,21.55) v1(65.1,21.55) 64.2,20.65 64.2,18.3 67.2,15.3 79.3,15.3 v1(80.5,14.1) 82.36,12.24 115.71,12.24 121.7,18.24 121.7,21.14 122.2,21.64 122.2,41.7 118.81,45.09 118.81,57.81 v1(119,58)
GPIO21: length 123.7
  Top Layer w0.15: v1(65.3,19.8) 65.3,19.8 U12.1 ; v1(72.16,19.8) U11.1 ; v1(118,55.9) 119.2,57.1 119.2,57.5 119.35,57.65 CN1.25 ; v1(82,14.5) 81.5,14.5 80.3,13.3 80.3,11.4 79.9,11 79.4,11 79,10.6 79,8.6 78.43,8.03 U20.14
  Bottom Layer w0.15: v1(118,55.9) 118,54.94 118.2,54.74 118.2,44.65 121.6,41.25 121.6,22 121.1,21.5 121.1,18.54 115.41,12.84 83.66,12.84 v1(82,14.5) 80.6,15.9 67.4,15.9 64.8,18.5 64.8,19.3 v1(65.3,19.8) 65.3,19.8 v1(72.16,19.8)
HDMI0_CEC: length 32.6
  Top Layer w0.15: CN2.51 86.75,62.85 90.1,66.2 90.1,70.9 86.8,74.2 80.7,74.2 78.3,76.6 78.3,81 77.9,81.4 75.9,81.4 75.7,81.2 75.7,80.38
HDMI0_CLK_N: length 16.4
  Top Layer w0.177: CN2.90 82.31,70.45 82.28,70.41 80.71,70.41 80.53,70.59 80.53,70.72 80.36,70.9 79.71,70.9 79.53,70.72 79.53,70.59 79.36,70.41 78.39,70.41 74.86,73.94 74.86,79.55 74.9,79.59 74.9,80.38
HDMI0_CLK_P: length 16.4
  Top Layer w0.177: 74.5,80.38 74.5,79.59 74.54,79.55 74.54,73.8 78.25,70.08 82.28,70.08 82.31,70.05 CN2.88
HDMI0_HOTPLUG: length 27.7
  Top Layer w0.15: CN2.53 86.45,63.25 89.7,66.5 89.7,70.7 86.6,73.8 80.4,73.8 77.8,76.4 77.8,80.27 77.7,80.38
HDMI0_SCL: length 13
  Top Layer w0.15: CN2.100 78.85,72.45 76.1,75.2 76.1,80.38
HDMI0_SDA: length 15.6
  Top Layer w0.15: CN2.99 85.48,72.8 79,72.8 76.5,75.3 76.5,80.38
HDMI0_TX0_N: length 18.9
  Top Layer w0.177: CN2.84 82.31,69.25 82.28,69.21 80.82,69.21 80.64,69.39 80.64,69.52 80.46,69.7 79.82,69.7 79.64,69.52 79.64,69.39 79.46,69.21 76.99,69.21 73.66,72.54 73.66,79.55 73.7,79.59 73.7,80.38
HDMI0_TX0_P: length 18.9
  Top Layer w0.177: 73.3,80.38 73.3,79.59 73.34,79.55 73.34,72.4 76.86,68.88 82.28,68.88 82.31,68.85 CN2.82
HDMI0_TX1_N: length 21.2
  Top Layer w0.177: 72.5,80.38 72.5,79.59 72.46,79.55 72.46,71.44 75.89,68.01 79.35,68.01 79.52,68.19 79.52,68.32 79.7,68.5 80.35,68.5 80.52,68.32 80.52,68.19 80.7,68.01 82.28,68.01 82.31,68.05 CN2.78
HDMI0_TX1_P: length 21.2
  Top Layer w0.177: CN2.76 82.31,67.65 82.28,67.68 75.75,67.68 72.14,71.3 72.14,79.55 72.1,79.59 72.1,80.38
HDMI0_TX2_N: length 23.7
  Top Layer w0.177: CN2.72 82.31,66.85 82.28,66.81 80.49,66.81 80.32,66.99 80.32,67.12 80.14,67.3 79.49,67.3 79.32,67.12 79.32,66.99 79.14,66.81 74.59,66.81 71.26,70.14 71.26,79.55 71.3,79.59 71.3,80.38
HDMI0_TX2_P: length 23.7
  Top Layer w0.177: 70.9,80.38 70.9,79.59 70.94,79.55 70.94,70 74.46,66.48 82.28,66.48 82.31,66.45 CN2.70
HDMI_5V: length 17.4
  Top Layer w0.2: v1(77.3,79.1) 77.3,80.38
  Top Layer w0.5: 68.69,73.05 69.35,73.05 70,73.7 ; C94.1 70,72.04 70,73.7 ; 70,73.7 v1(70,78.9)
  Bottom Layer w0.5: v1(70,78.9) 70.2,79.1 v1(77.3,79.1)
ID_SC: length 117.2
  Top Layer w0.15: CN1.35 v1(118,59.65) ; FPC2.20 74.03,61.13 v1(73.8,60.9) ; v1(111.7,68.2) 111.7,63.44 110.77,62.51 R4.2 110.77,60.43 111.9,59.3 v1(115.9,59.3)
  Bottom Layer w0.15: v1(115.9,59.3) 117.65,59.3 v1(118,59.65) ; v1(73.8,60.9) 73.1,60.2 73.1,41.8 74,40.9 74,35.2 77.3,31.9 86.9,31.9 91.1,36.1 91.1,63.9 95.4,68.2 v1(111.7,68.2)
ID_SD: length 112.8
  Top Layer w0.15: v1(112.3,67.7) 112.3,63 112.8,62.5 112.8,61.07 R5.2 113.53,60 115.98,60 116.34,59.65 CN1.36 ; v1(73.2,61.2) 73.63,61.63 FPC2.21
  Bottom Layer w0.15: v1(73.2,61.2) 72.8,60.8 72.8,41.7 73.7,40.8 73.7,35.1 77.2,31.6 87,31.6 91.4,36 91.4,63.6 95.55,67.75 112.25,67.75 v1(112.3,67.7)
J1-X: length 35.1
  Top Layer w0.15: v1(143.1,39.4) 150.1,39.4 154.95,44.25 STICK-L.4 ; v1(142.31,26.74) 141.11,25.54 138.01,25.54 137.71,25.84 U16.38
  Bottom Layer w0.15: v1(142.31,26.74) 143.11,27.54 143.11,39.39 v1(143.1,39.4)
J1-Y: length 34.7
  Top Layer w0.15: v1(142.41,27.54) 140.81,25.94 138.11,25.94 137.81,26.24 U16.39 ; STICK-L.2 153.95,44.05 149.8,39.9 142.6,39.9 v1(142.1,39.4)
  Bottom Layer w0.15: v1(142.1,39.4) 142.71,38.79 142.71,27.84 v1(142.41,27.54)
